# Altium schematic sheet JTAG&SWD.SchDoc
size A4; Revision: D.1(PCB.SCH)
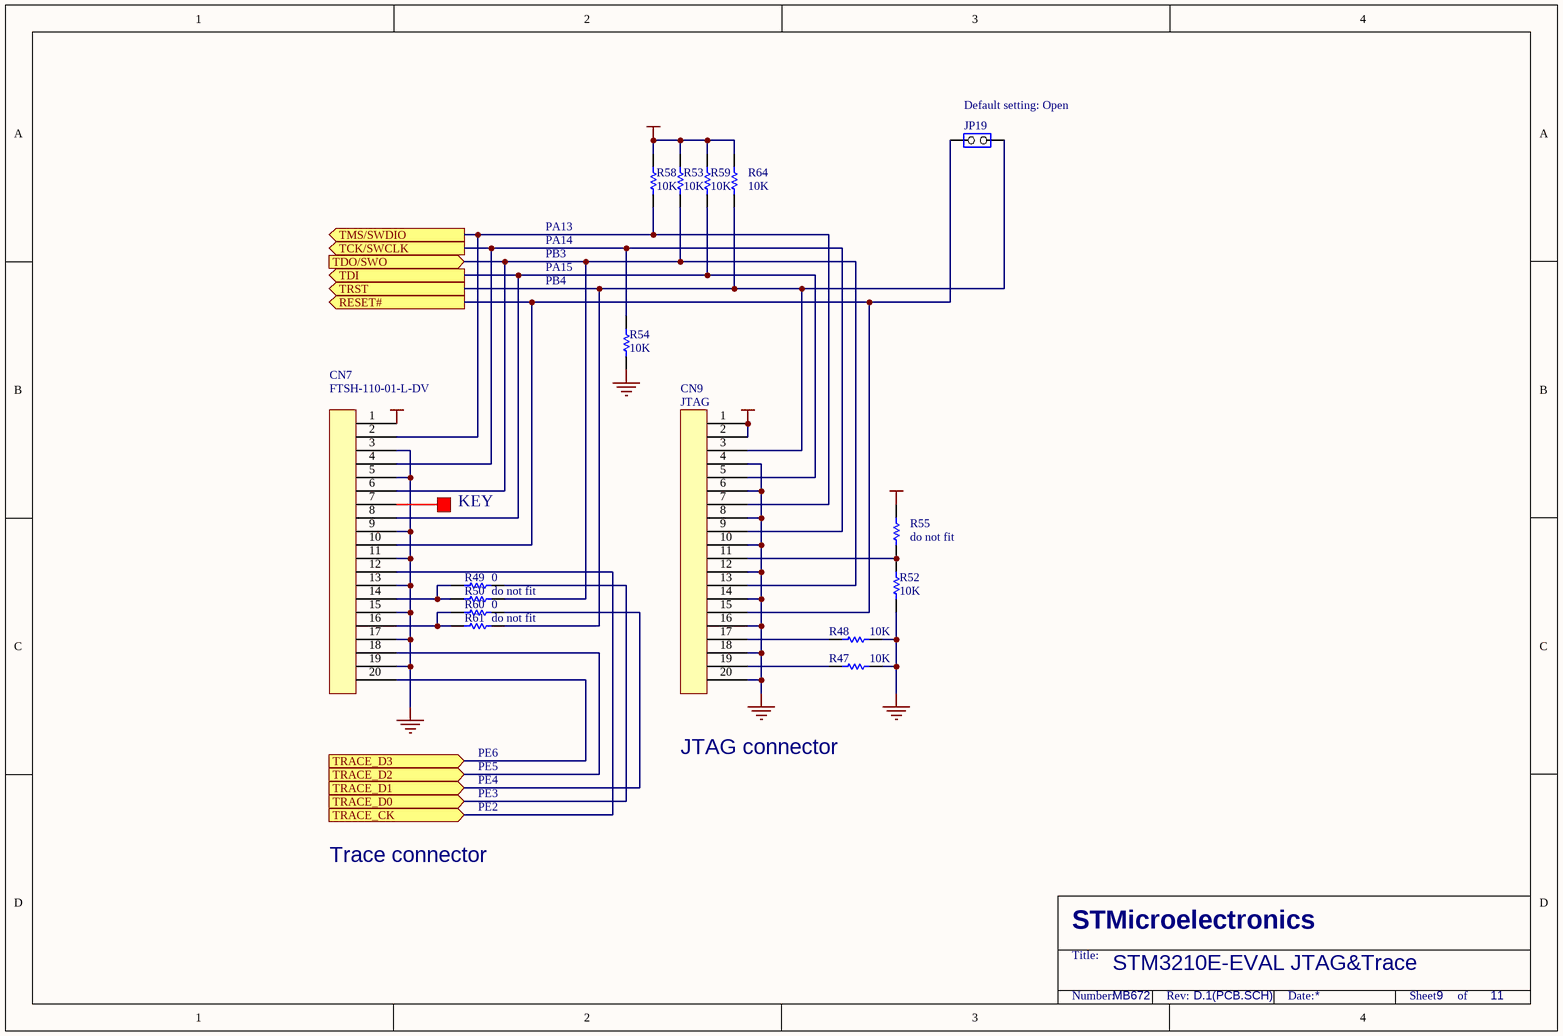
[diagram p0: JTAG&SWD.SchDoc]

## Parts
CN7  FTSH-110-01-L-DV  [IDC20S]
CN9  JTAG  [IDC20S]
JP19  (no value)  [SIP2]
R47  10K  [0603]
R48  10K  [0603]
R49  0  [0603]
R50  do not fit  [0603]
R52  10K  [0603]
R53  10K  [0603]
R54  10K  [0603]
R55  do not fit  [0603]
R58  10K  [0603]
R59  10K  [0603]
R60  0  [0603]
R61  do not fit  [0603]
R64  10K  [0603]

## Ports
RESET# (out), TCK/SWCLK (out), TDI (out), TDO/SWO (in), TMS/SWDIO (out), TRACE_CK (in), TRACE_D0 (in), TRACE_D1 (in), TRACE_D2 (in), TRACE_D3 (in), TRST (out)

## Nets
+3V3: CN7.1 CN9.1 CN9.2 R53.2 R55.2 R58.2 R59.2 R64.2
GND: CN7.3 CN7.5 CN7.9 CN7.11 CN7.13 CN7.15 CN7.17 CN7.19 CN9.4 CN9.6 CN9.8 CN9.10 CN9.12 CN9.14 CN9.16 CN9.18 CN9.20 R47.2 R48.2 R52.1 R54.1
RESET#: CN7.10 CN9.15 JP19.2(NO) ; port RESET#
TCK/SWCLK: CN7.4 CN9.9 R54.2 ; port TCK/SWCLK
TDI: CN7.8 CN9.5 R59.1 ; port TDI
TDO/SWO: CN7.6 CN9.13 R50.2 R53.1 ; port TDO/SWO
TMS/SWDIO: CN7.2 CN9.7 R58.1 ; port TMS/SWDIO
TRACE_CK: CN7.12 ; port TRACE_CK
TRACE_D0: R49.2 ; port TRACE_D0
TRACE_D1: R60.2 ; port TRACE_D1
TRACE_D2: CN7.18 ; port TRACE_D2
TRACE_D3: CN7.20 ; port TRACE_D3
TRST: CN9.3 JP19.1(COMMON) R61.2 R64.1 ; port TRST
NetCN7_14: CN7.14 R49.1 R50.1
NetCN7_16: CN7.16 R60.1 R61.1
NetCN9_11: CN9.11 R52.2 R55.1
NetCN9_17: CN9.17 R48.1
NetCN9_19: CN9.19 R47.1

Not connected (* = marked no-connect by the designer): CN7 7

## Notes on the sheet
- (near JP19) Default setting: Open
- PA14
- PA13
- PB4
- PB3
- PA15
- KEY
- PE4
- PE5
- PE6
- JTAG connector
- PE2
- PE3
- Trace connector
- STM3210E-EVAL JTAG&Trace
- MB672
- 9
- 11
- STMicroelectronics
- Title:
- Number:
- Rev:
- Date:
- Sheet       of

## Library data of the parts
CN7 CN9 = 20PIN1
JP19 = JP2
R47-R50 R52-R55 R58-R61 R64 = Res1: Resistor; Value: 1K; Published: 8-Jun-2000; Revision: July-2002: Re-released for DXP Platform.; Publisher: Altium Limited